# Altium schematic sheet mic_amp.SchDoc
size A4; SheetNumber: 2; SheetTotal: 3
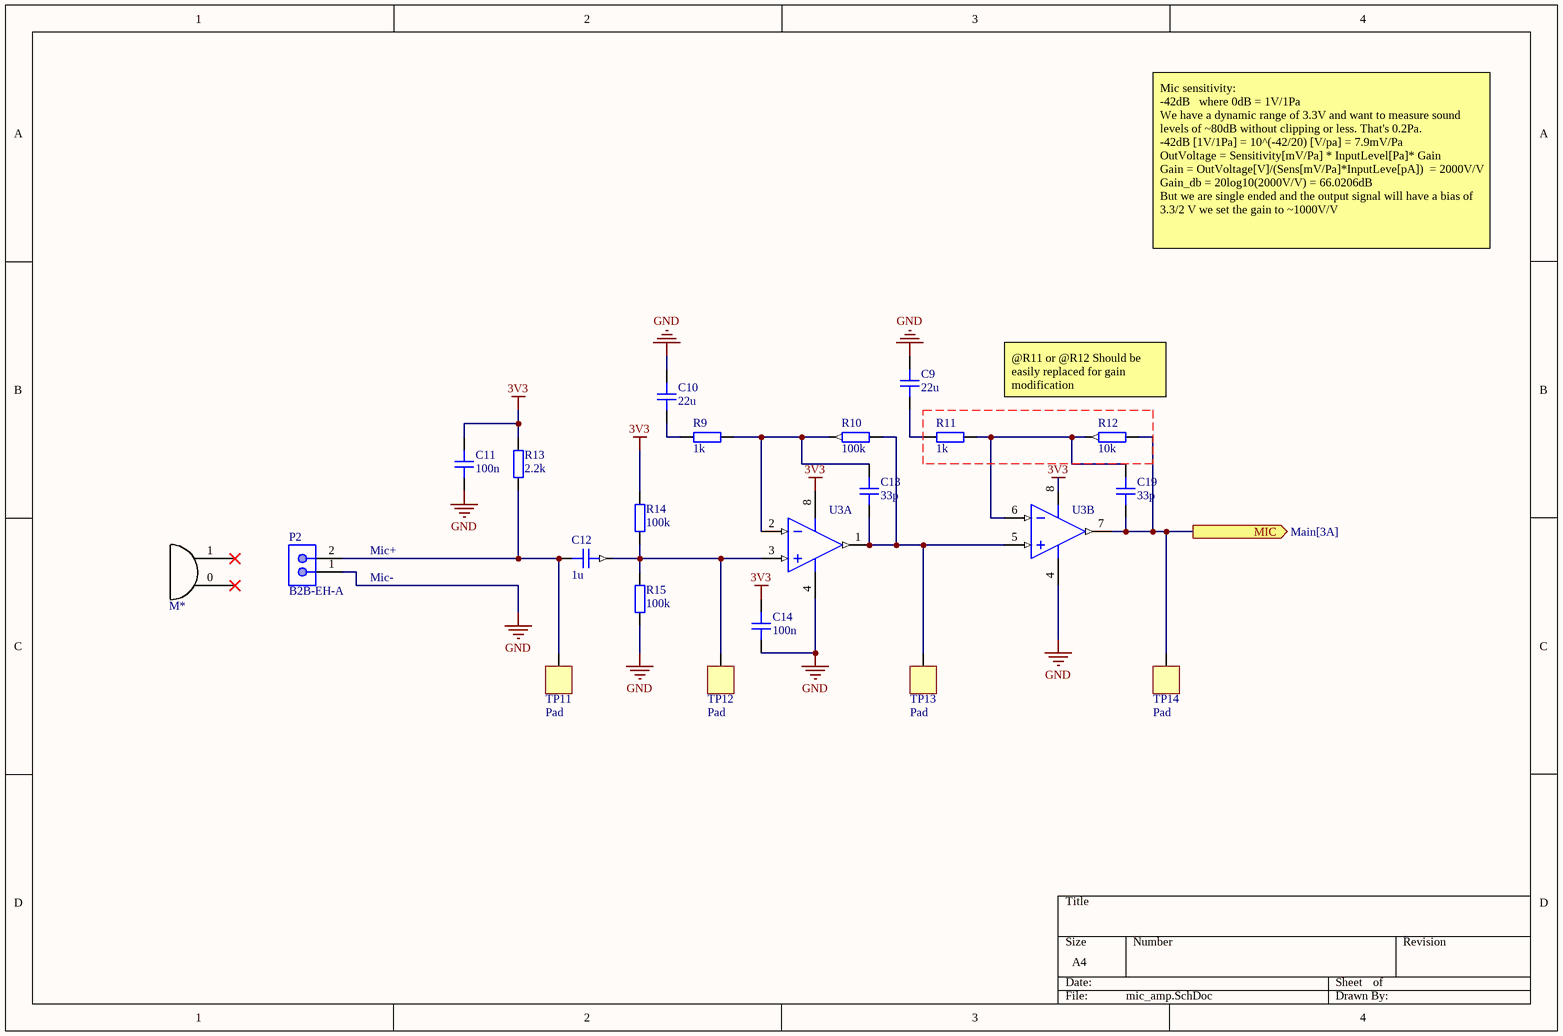
[diagram p0: mic_amp.SchDoc]

## Parts
C9  22u  [CAP_0603]
C10  22u  [CAP_0603]
C11  100n  [CAP_0603]
C12  1u  [CAP_0603]
C13  33p  [CAP_0603]
C14  100n  [CAP_0603]
C19  33p  [CAP_0603]
M*  LD-MC-0905P  (value not drawn)  (net tie)
P2  B2B-EH-A  [JST-B2B-EH-A_V]
R9  1k  [RES_0603]
R10  100k  [RES_0603]
R11  1k  [RES_0603]
R12  10k  [RES_0603]
R13  2.2k  [RES_0603]
R14  100k  [RES_0603]
R15  100k  [RES_0603]
TP11  Pad  [PAD_SQ_2MM]  (no BOM)
TP12  Pad  [PAD_SQ_2MM]  (no BOM)
TP13  Pad  [PAD_SQ_2MM]  (no BOM)
TP14  Pad  [PAD_SQ_2MM]  (no BOM)
U3  AD8602ARZ-REEL7  [ADI-R-8_M]  (value not drawn)  (parts A,B of 2)

## Ports
MIC (out, see Main[3A])

## Nets
3V3: C11.2 C14.2 R13.2 R14.2 U3.8(+V)
GND: C9.2 C10.2 C11.1 C14.1 P2.1 R15.1 U3.4(-V)
MIC: C19.1 R12.1 TP14.1 U3.7(OUT_B) ; port MIC
NetC9_1: C9.1 R11.2
NetC10_1: C10.1 R9.2
NetC12_1: C12.1 R14.1 R15.2 TP12.1 U3.3(+IN_A)
NetC12_2: C12.2 P2.2 R13.1 TP11.1
NetC13_1: C13.1 R10.1 TP13.1 U3.1(OUT_A) U3.5(+IN_B)
NetC13_2: C13.2 R9.1 R10.2 U3.2(-IN_A)
NetC19_2: C19.2 R11.1 R12.2 U3.6(-IN_B)

Not connected (* = marked no-connect by the designer): M* 0(6)* 1(7)*

## Notes on the sheet
- Mic sensitivity:
  -42dB   where 0dB = 1V/1Pa
  We have a dynamic range of 3.3V and want to measure sound levels of ~80dB without clipping or less. That's 0.2Pa.
  -42dB [1V/1Pa] = 10^(-42/20) [V/pa] = 7.9mV/Pa
  OutVoltage = Sensitivity[mV/Pa] * InputLevel[Pa]* Gain
  Gain = OutVoltage[V]/(Sens[mV/Pa]*InputLeve[pA])  = 2000V/V
  Gain_db = 20log10(2000V/V) = 66.0206dB
  But we are single ended and the output signal will have a bias of 3.3/2 V we set the gain to ~1000V/V
- @R11 or @R12 Should be easily replaced for gain modification
- Mic+
- Mic-

## Library data of the parts
C9-C14 C19 = CAP_0603: Capacitor SMD 0603, X7R, 10V; Manufacturer: *; Manufacturer Part Number: *; Distributor Link: *; LCSC: *; Rating: *; Dielectric: *
M* = LD-MC-0905P: Microphone, electret
P2 = CMP-2000-05887-1: Male Header, Pitch 2.5 mm, 1 x 2 Position, Height 6 mm, Tail Length 3.2 mm, -25 to 85 degC, RoHS, Bulk; Manufacturer: JST; Other Names: 455-1014; Mating Products: 455-1000-ND-CONNHOUSINGEH2POS2.5MMCRIMP455-2933-ND-CONNRECEPTHR2POS2.5MMBLACK455-2934-ND-CONNRECEPTHR2POS2.5MMWHITE455-1044-ND-CONNRECEPTHR2POS2.5MMWHITE455-1057-ND-CONNRECEPTHR2POS2.5MMBLACK; Pitch: 0.098"(2.50mm); Connector Type: Header,Shrouded; Number of Positions: 2; Number of Positions Loaded: All; Manufacturer URL: http://www.jst.com/home2.html; Contact Type: MalePin; Package Description: Male Header, Pitch 2.5 mm, 1 x 2 Position, Height 6 mm, Tail Length 3.2 mm; Mounting Type: ThroughHole; Mounting Technology: ThroughHole; Number of Rows: 1; Features: -; Fastening Type: DetentLock; Contact Finish Thickness: -; Datasheet Version: 10/2002; Termination: Press-Fit; Datasheet URL: http://media.digikey.com/pdf/Data%20Sheets/JST%20PDFs/EH%20Series.pdf; Standard Package: 1,000; Category: Connectors,Interconnects; Family: RectangularConnectors-Headers,MalePins; Contact Finish: Tin-Lead; Packaging: Bulk; Color: Natural; Package Reference: B2B-EH-A; Row Spacing: -; Contact Mating Length: 0.130"(3.30mm); Series: EH
R9-R15 = RES_0603: Resistor SMD 0603; Manufacturer: *; Manufacturer Part Number: *; Distributor Link: *; LCSC: *
TP11-TP14 = PAD_SQ_2MM: Test Point Square 2mm
U3 = CMP-0384-00561-1: Double Channel Wide Bandwidth Operational Amplifier, 8.4 MHz BW, 6 V/us SR, Industrial, 8-pin SOIC (R-8), Reel; Manufacturer: Analog Devices; Generic Part Number: AD8602; Iq/Amp: 1.2mA; V Span Max: 6V; Input Offset Voltage: 500uV; Automotive Qualified: Yes; Slew Rate: 6V/us; Amplifiers Per Package: 2; Input Bias Current: 200fA; Small Signal Bandwidth: 8.4MHz; V Span Min: 2.7V; ComponentLink1Description: Manufacturer URL; PackageReference: R-8; ComponentLink2Description: Datasheet; Mounting Technology: Surface Mount; PackageDescription: 8-Pin Standard Small Outline Package, Body 3.9 x 4.9 mm, Pitch 1.27 mm; PartNumber: AD8602ARZ-REEL7; PackageVersion: 060506-A; ComponentLink3URL: http://www.analog.com/static/imported-files/packages/PKG_PDF/SOIC_Narrow%20(R)/R_8.pdf; ComponentLink2URL: http://www.analog.com/static/imported-files/data_sheets/AD8601_8602_8604.pdf; ComponentLink3Description: Package Specification; Code_JEDEC: MS-012-AA; ComponentLink1URL: http://www.analog.com/en/index.html; DatasheetVersion: Rev. G